# EAGLE design MFO (EAGLE 9.5.2)
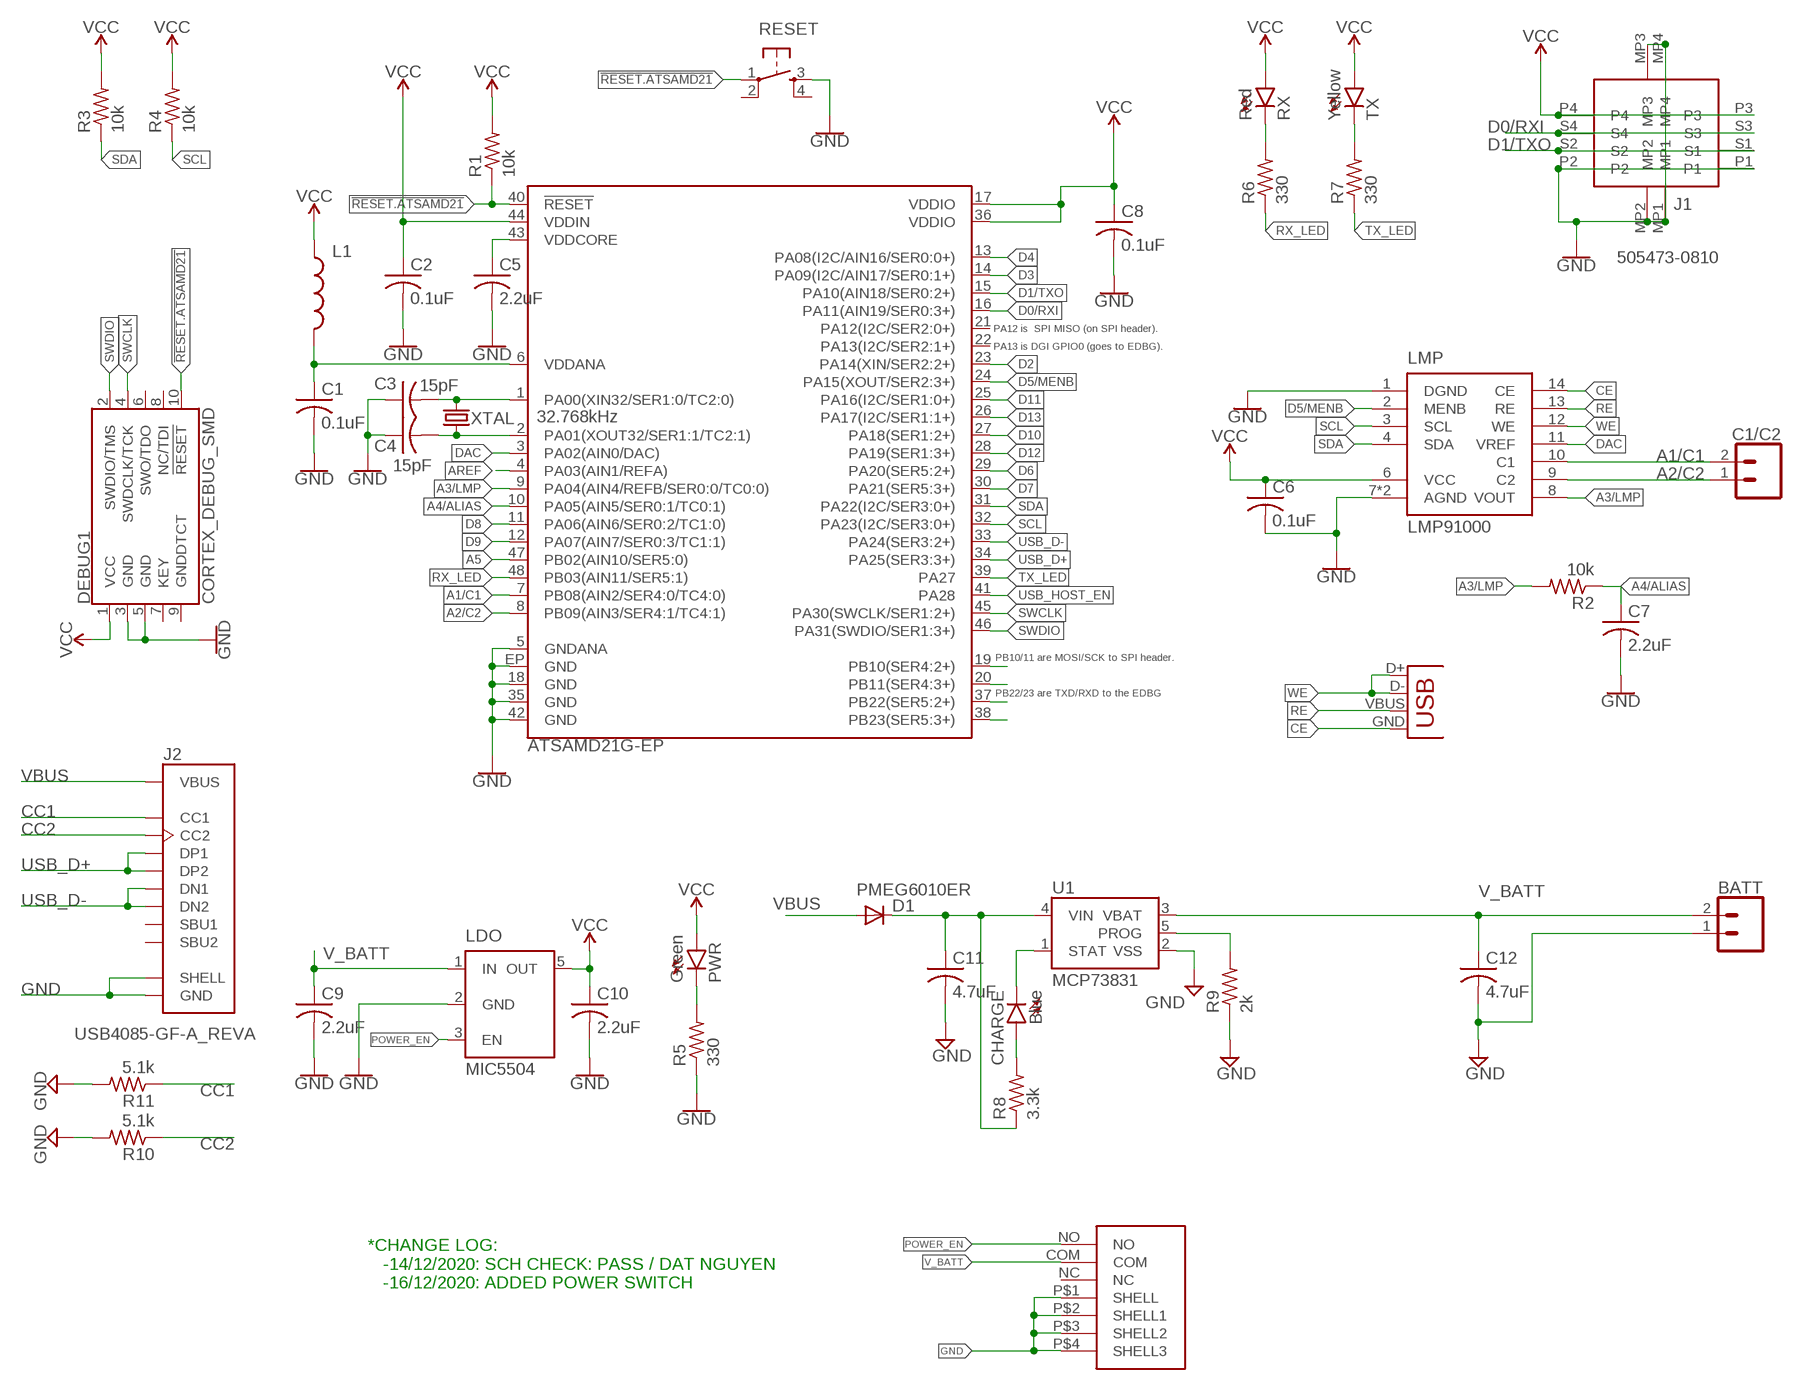
[diagram p0: schematic, sheet 1]

## Parts
ARDUINO  ATSAMD21G-EP  [QFN-48]
BATT  CONN_02  [1X02]
C1  0.1uF  C-USC0603  [C0603]
C1/C2  CONN_02  [1X02]
C2  0.1uF  C-USC0603  [C0603]
C3  15pF  C-USC0603  [C0603]
C4  15pF  C-USC0603  [C0603]
C5  2.2uF  C-USC0603  [C0603]
C6  0.1uF  C-USC0603  [C0603]
C7  2.2uF  C-USC0603  [C0603]
C8  0.1uF  C-USC0603  [C0603]
C9  2.2uF  C-USC0603  [C0603]
C10  2.2uF  C-USC0603  [C0603]
C11  4.7uF  C-USC0603  [C0603]
C12  4.7uF  C-USC0603  [C0603]
CHARGE  Blue  LEDCHIP-LED0805  [CHIP-LED0805]
D1  PMEG6010ER  DIODE_DIODE-SOD123  [DIODE_SOD123]
DEBUG1  CORTEX_DEBUG_SMD  [SAMTECH_FTSH-105-01]
J1  505473-0810  [5054730810]
J2  USB4085-GF-A_REVA  [GCT_USB4085-GF-A_REVA]
L1  FB - 30Ohm  INDUCTOR0603  [L0603]
LDO  MIC5504  [SOT23-5]
LMP  LMP91000  [WSON-14]
PWR  Green  LEDCHIP-LED0805  [CHIP-LED0805]
R1  10k  R-US_R0603  [R0603]
R2  10k  R-US_R0603  [R0603]
R3  10k  R-US_R0603  [R0603]
R4  10k  R-US_R0603  [R0603]
R5  330  R-US_R0603  [R0603]
R6  330  R-US_R0603  [R0603]
R7  330  R-US_R0603  [R0603]
R8  3.3k  R-US_R0603  [R0603]
R9  2k  R-US_R0603  [R0603]
R10  5.1k  R-US_R0603  [R0603]
R11  5.1k  R-US_R0603  [R0603]
RESET  SPST-PTS830GG140  [BUTTON-GULLWING]
RX  Red  LEDCHIP-LED0805  [CHIP-LED0805]
TX  Yellow  LEDCHIP-LED0805  [CHIP-LED0805]
U1  MCP73831  MCP73831SMD  [SOT23-5]
U$1  MSK-12C02SMD  [MSK-12C02SMD]
X1  USB-A-H  [USB-A-H]
XTAL  32.768kHz  CRYSTALECS-.327-12.5-1210-TR  [2-SMD.NOLEAD.1.2MMTO1.0MM]

## Nets
!RESET.ATSAMD21: ARDUINO.40(!RESET!) DEBUG1.10(!RESET) R1.1 RESET.1
A1/C1: ARDUINO.7(PB08(AIN2/SER4:0/TC4:0)) C1/C2.2 LMP.10(C1)
A2/C2: ARDUINO.8(PB09(AIN3/SER4:1/TC4:1)) C1/C2.1 LMP.9(C2)
A3/LMP: ARDUINO.9(PA04(AIN4/REFB/SER0:0/TC0:0)) LMP.8(VOUT) R2.2
A4/ALIAS: ARDUINO.10(PA05(AIN5/SER0:1/TC0:1)) C7.1 R2.1
A5: ARDUINO.47(PB02(AIN10/SER5:0))
AREF: ARDUINO.4(PA03(AIN1/REFA))
CC1: J2.A5(CC1) R11.1
CC2: J2.B5(CC2) R10.1
CE: LMP.14(CE) X1.GND
D0/RXI: ARDUINO.16(PA11(AIN19/SER0:3+)) J1.S3 J1.S4
D1/TXO: ARDUINO.15(PA10(AIN18/SER0:2+)) J1.S1 J1.S2
D2: ARDUINO.23(PA14(XIN/SER2:2+))
D3: ARDUINO.14(PA09(I2C/AIN17/SER0:1+))
D4: ARDUINO.13(PA08(I2C/AIN16/SER0:0+))
D5/MENB: ARDUINO.24(PA15(XOUT/SER2:3+)) LMP.2(MENB)
D6: ARDUINO.29(PA20(SER5:2+))
D7: ARDUINO.30(PA21(SER5:3+))
D8: ARDUINO.11(PA06(AIN6/SER0:2/TC1:0))
D9: ARDUINO.12(PA07(AIN7/SER0:3/TC1:1))
D10: ARDUINO.27(PA18(SER1:2+))
D11: ARDUINO.25(PA16(I2C/SER1:0+))
D12: ARDUINO.28(PA19(SER1:3+))
D13: ARDUINO.26(PA17(I2C/SER1:1+))
DAC: ARDUINO.3(PA02(AIN0/DAC)) LMP.11(VREF)
GND: ARDUINO.5(GNDANA) ARDUINO.18(GND) ARDUINO.35(GND) ARDUINO.42(GND) ARDUINO.EP(GND) BATT.1 C1.2 C2.2 C3.1 C4.1 C5.2 C6.2 C7.2 C8.2 C9.2 C10.2 C11.2 C12.2 DEBUG1.3(GND) DEBUG1.5(GND) J1.MP1 J1.MP2 J1.MP3 J1.MP4 J1.P1 J1.P2 J2.A1(GND) J2.A12(GND) J2.B1(GND) J2.B12(GND) J2.P1(SHELL) J2.P2(SHELL) J2.P3(SHELL) J2.P4(SHELL) LDO.2(GND) LMP.1(DGND) LMP.7(AGND) LMP.DAP(AGND) R5.1 R9.1 R10.2 R11.2 RESET.3 U1.2(VSS) U$1.P$1(SHELL) U$1.P$2(SHELL1) U$1.P$3(SHELL2) U$1.P$4(SHELL3)
N$1: R6.2 RX.C
N$2: ARDUINO.19(PB10(SER4:2+))
N$3: ARDUINO.20(PB11(SER4:3+))
N$4: ARDUINO.37(PB22(SER5:2+))
N$5: ARDUINO.38(PB23(SER5:3+))
N$6: R7.2 TX.C
N$7: PWR.C R5.2
N$9: R9.2 U1.5(PROG)
N$10: CHARGE.C U1.1(STAT)
N$12: CHARGE.A R8.2
N$28: ARDUINO.1(PA00(XIN32/SER1:0/TC2:0)) C3.2 XTAL.P$2
N$34: ARDUINO.2(PA01(XOUT32/SER1:1/TC2:1)) C4.2 XTAL.P$1
POWER_EN: LDO.3(EN) U$1.NO
RE: LMP.13(RE) X1.VBUS
RX_LED: ARDUINO.48(PB03(AIN11/SER5:1)) R6.1
SCL: ARDUINO.32(PA23(I2C/SER3:0+)) LMP.3(SCL) R4.1
SDA: ARDUINO.31(PA22(I2C/SER3:0+)) LMP.4(SDA) R3.1
SWCLK: ARDUINO.45(PA30(SWCLK/SER1:2+)) DEBUG1.4(SWDCLK/TCK)
SWDIO: ARDUINO.46(PA31(SWDIO/SER1:3+)) DEBUG1.2(SWDIO/TMS)
TX_LED: ARDUINO.39(PA27) R7.1
USB_D+: ARDUINO.34(PA25(SER3:3+)) J2.A6(DP1) J2.B6(DP2)
USB_D-: ARDUINO.33(PA24(SER3:2+)) J2.A7(DN1) J2.B7(DN2)
USB_HOST_EN: ARDUINO.41(PA28)
V_BATT: BATT.2 C9.1 C12.1 LDO.1(IN) U1.3(VBAT) U$1.COM
VBUS: D1.A J2.A4(VBUS) J2.A9(VBUS) J2.B4(VBUS) J2.B9(VBUS)
VCC: ARDUINO.17(VDDIO) ARDUINO.36(VDDIO) ARDUINO.44(VDDIN) C2.1 C6.1 C8.1 C10.1 DEBUG1.1(VCC) J1.P3 J1.P4 L1.1 LDO.5(OUT) LMP.6(VCC) PWR.A R1.2 R3.2 R4.2 RX.A TX.A
VDDANA1: ARDUINO.6(VDDANA) C1.1 L1.2
VDDCORE1: ARDUINO.43(VDDCORE) C5.1
VUSB: C11.1 D1.C R8.1 U1.4(VIN)
WE: LMP.12(WE) X1.D+ X1.D-
Unconnected: ARDUINO.21(PA12(I2C/SER2:0+)) ARDUINO.22(PA13(I2C/SER2:1+)) DEBUG1.6(SWO/TDO) DEBUG1.7(KEY) DEBUG1.8(NC/TDI) DEBUG1.9(GNDDTCT) J2.A8(SBU1) J2.B8(SBU2) RESET.2 RESET.4 U$1.NC

## Notes on the sheet
- PA12 is  SPI MISO (on SPI header).
- PA13 is DGI GPIO0 (goes to EDBG).
- PB10/11 are MOSI/SCK to SPI header.
- PB22/23 are TXD/RXD to the EDBG
- *CHANGE LOG:
     -14/12/2020: SCH CHECK: PASS / DAT NGUYEN
     -16/12/2020: ADDED POWER SWITCH

## Library data of the parts
ARDUINO = LinnesLab-Microcontrollers:ATSAMD21G-EP: Atmel SAMD21G SMART ARM-Based Microcontroller The Atmel ® | SMART ™ SAM D21 is a series of low-power microcontrollers using the 32-bit ARM ® Cortex ® -M0+ processor, and ranging from 32- to 64-pins with up to 256KB Flash and 32KB of SRAM. The SAM D21 devices operate at a maximum frequency of 48MHz and reach 2.46 CoreMark/MHz. They are designed for simple and intuitive migration with identical peripheral modules, hex compatible code, identical linear address map and pin compatible migration paths between all devices in the product series. All devices include intelligent and flexible peripherals, Atmel Event System for inter-peripheral signaling, and support for capacitive touch button, slider and wheel user interfaces. Datasheet <https://cdn.sparkfun.com/datasheets/Dev/Arduino/Boards/Atmel-42181-SAM-D21_Datasheet.pdf> SparkFun Products SparkFun SAMD21 Mini Breakout <https://www.sparkfun.com/products/13664> (DEV-13664) SparkFun SAMD21 Dev Breakout <https://www.sparkfun.com/products/13672> (DEV-13672)
BATT C1/C2 = CalvEngIO-Connectors:CONN_02: Multi connection point. Often used as Generic Header-pin footprint for 0.1 inch spaced/style header connections On any of the 0.1 inch spaced packages, you can populate with these: Break Away Headers - Straight <https://www.sparkfun.com/products/116> (PRT-00116) Break Away Male Headers - Right Angle <https://www.sparkfun.com/products/553> (PRT-00553) Female Headers <https://www.sparkfun.com/products/115> (PRT-00115) Break Away Headers - Machine Pin <https://www.sparkfun.com/products/117> (PRT-00117) Break Away Female Headers - Swiss Machine Pin <https://www.sparkfun.com/products/743> (PRT-00743) For SCREWTERMINALS and SPRING TERMINALS visit here: Screw Terimnals on SparkFun.com <https://www.sparkfun.com/search/results?term=Screw+Terminals> (5mm/3.5mm/2.54mm spacing) This device is also useful as a general connection point to wire up your design to another part of your project. Our various solder wires solder well into these plated through hole pads. Hook-Up Wire - Assortment (Stranded, 22 AWG) <https://www.sparkfun.com/products/11375> (PRT-11375) Hook-Up Wire - Assortment (Solid Core, 22 AWG) <https://www.sparkfun.com/products/11367> (PRT-11367) View the entire wire category on our website here <https://www.sparkfun.com/categories/141> Special notes: Molex polarized connector foot print use with: PRT-08233 with associated crimp pins and housings. 2.54_SCREWTERM for use with PRT-10571. 3.5mm Screw Terminal footprints for PRT-08084 5mm Screw Terminal footprints for use with PRT-08432
C1-C12 = rcl:C-US: CAPACITOR, American symbol; SPICEPREFIX: C
CHARGE PWR RX TX = led:LED: LED OSRAM: - CHIPLED LG R971, LG N971, LY N971, LG Q971, LY Q971, LO R971, LY R971 LH N974, LH R974 LS Q976, LO Q976, LY Q976 LO Q996 - Hyper CHIPLED LW Q18S LB Q993, LB Q99A, LB R99A - SideLED LS A670, LO A670, LY A670, LG A670, LP A670 LB A673, LV A673, LT A673, LW A673 LH A674 LY A675 LS A676, LA A676, LO A676, LY A676, LW A676 LS A679, LY A679, LG A679 - Hyper Micro SIDELED® LS Y876, LA Y876, LO Y876, LY Y876 LT Y87S - SmartLED LW L88C, LW L88S LB L89C, LB L89S, LG L890 LS L89K, LO L89K, LY L89K LS L896, LA L896, LO L896, LY L896 - TOPLED LS T670, LO T670, LY T670, LG T670, LP T670 LSG T670, LSP T670, LSY T670, LOP T670, LYG T670 LG T671, LOG T671, LSG T671 LB T673, LV T673, LT T673, LW T673 LH T674 LS T676, LA T676, LO T676, LY T676, LB T676, LH T676, LSB T676, LW T676 LB T67C, LV T67C, LT T67C, LS T67K, LO T67K, LY T67K, LW E67C LS E67B, LA E67B, LO E67B, LY E67B, LB E67C, LV E67C, LT E67C LW T67C LS T679, LY T679, LG T679 LS T770, LO T770, LY T770, LG T770, LP T770 LB T773, LV T773, LT T773, LW T773 LH T774 LS E675, LA E675, LY E675, LS T675 LS T776, LA T776, LO T776, LY T776, LB T776 LHGB T686 LT T68C, LB T68C - Hyper Mini TOPLED® LB M676 - Mini TOPLED Santana® LG M470 LS M47K, LO M47K, LY M47K Source: http://www.osram.convergy.de LUXEON: - LUMILED® LXK2-PW12-R00, LXK2-PW12-S00, LXK2-PW14-U00, LXK2-PW14-V00 LXK2-PM12-R00, LXK2-PM12-S00, LXK2-PM14-U00 LXK2-PE12-Q00, LXK2-PE12-R00, LXK2-PE12-S00, LXK2-PE14-T00, LXK2-PE14-U00 LXK2-PB12-K00, LXK2-PB12-L00, LXK2-PB12-M00, LXK2-PB14-N00, LXK2-PB14-P00, LXK2-PB14-Q00 LXK2-PR12-L00, LXK2-PR12-M00, LXK2-PR14-Q00, LXK2-PR14-R00 LXK2-PD12-Q00, LXK2-PD12-R00, LXK2-PD12-S00 LXK2-PH12-R00, LXK2-PH12-S00 LXK2-PL12-P00, LXK2-PL12-Q00, LXK2-PL12-R00 Source: www.luxeon.com KINGBRIGHT: KA-3528ASYC Source: www.kingbright.com
D1 = BE 420 Parts volume 2:DIODE_DIODE-: DIODE
DEBUG1 = CalvEngIO-Connectors:CORTEX_DEBUG: Cortex Debug Connector - 10 pin Supports JTAG debug, Serial Wire debug, and Serial Wire Viewer. PTH and SMD connector options available. General Connector Information <http://infocenter.arm.com/help/topic/com.arm.doc.faqs/attached/13634/cortex_debug_connectors.pdf> Products: PTH Connector <http://www.digikey.com/product-detail/en/cnc-tech/3220-10-0100-00/1175-1627-ND/3883661> -via Digi-Key SparkFun PSoc <https://www.sparkfun.com/products/13229> SparkFun T <https://www.sparkfun.com/products/13810>
J1 = SamacSys_Parts:505473-0810: Board to Board & Mezzanine Connectors SS Hybrid Pwr Recep 4 Pwr / 4S Contacts Source: Datasheet <https://componentsearchengine.com/Datasheets/1/505473-0810.pdf>; DESCRIPTION: Board to Board & Mezzanine Connectors SS Hybrid Pwr Recep 4 Pwr / 4S Contacts; HEIGHT: 0.58mm; MANUFACTURER_NAME: Molex; MANUFACTURER_PART_NUMBER: 505473-0810; MOUSER_PART_NUMBER: 538-5054730810; MOUSER_PRICE-STOCK: https://www.mouser.co.uk/ProductDetail/Molex/505473-0810?qs=IO9H2WQy3fJvsDYMwglDeg%3D%3D
J2 = USB4085-GF-A_REVA:USB4085-GF-A_REVA: USB 2.0 Type C Receptacle Dip Type, PCB Top Mount Check prices <https://pricing.snapeda.com/parts/USB4085-GF-A/Global%20Connector%20Technology/view-part?ref=eda>; AVAILABILITY: Warning; DESCRIPTION: USB-C (USB TYPE-C) USB 2.0 Receptacle Connector 24 (16+8 Dummy) Position Through Hole, Right Angle; MF: Global Connector Technology; MP: USB4085-GF-A; PACKAGE: Package; PRICE: None; PURCHASE-URL: https://pricing.snapeda.com/search/part/USB4085-GF-A/?ref=eda
L1 = LinnesLab-Passives:INDUCTOR; PROD_ID: RES-07859
LDO = LinnesLab-Power:MIC5504: MIC5504 Voltage Regulator Output Voltages: 1.0V to 3.3V Input Voltages: 2.5V to 5.5V Link to Datasheet http://ww1.microchip.com/downloads/en/DeviceDoc/MIC550X.pdf
LMP = CalvEngIO-Sensors:LMP91000: Integrated Potentiostat for Electrochemical Measurements of Gases and Fluids from Texas Instruments.
R1-R11 = rcl:R-US_: RESISTOR, American symbol; SPICEPREFIX: R
RESET = LinnesLab-Switches:SPST-PTS830GG140
U1 = SparkFun:MCP73831
U$1 = MSK-12C02 SMD Switch:MSK-12C02SMD
X1 = con-usb:USB: USB Connectors
XTAL = LinnesLab-Clocks:CRYSTAL

## Board
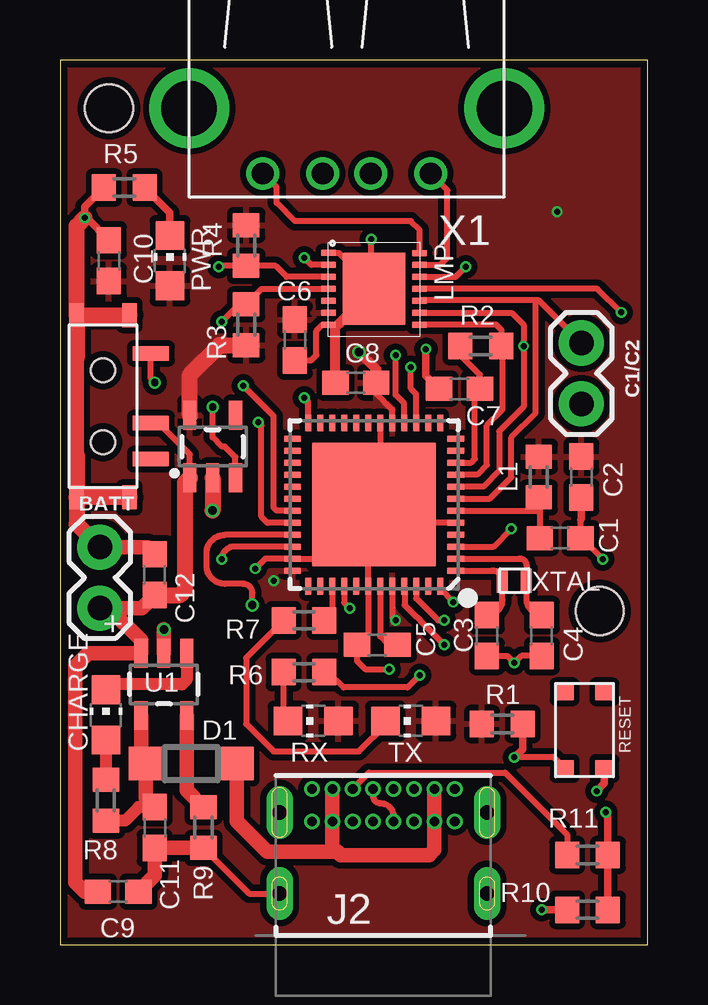
[diagram p1: board, top side]
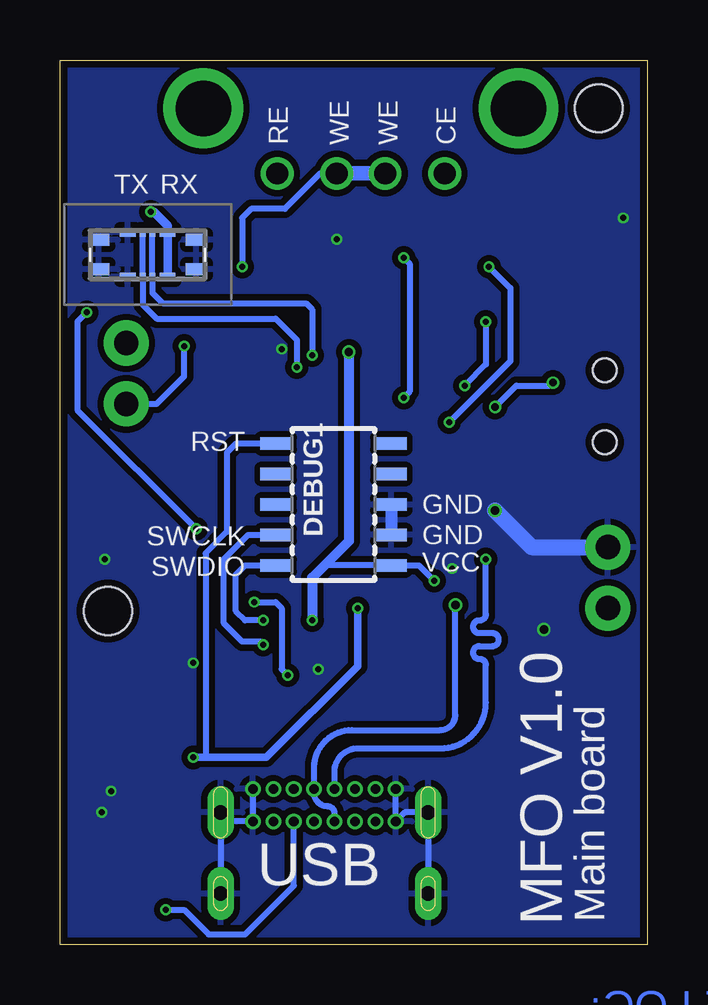
[diagram p2: board, bottom side, seen from below]

Size 24.48 x 36.86 mm. Coordinates in mm from the lower left corner, seen from the top.
Outline: 0,0 24.48,0 24.48,36.86 0,36.86 0,0
Copper layers (1*16): Top 0.035mm / dielectric 1.5mm / Bottom 0.035mm
Design rules "default *": minimum track width 0.1mm, minimum drill 0.1mm, track to track 0.1mm, track to pad 0.1mm, pad to pad 0.1mm, via to via 0.1mm, smd to smd 0.1mm, copper to edge 0.3mm, drill to drill 0.2mm, minimum pad ring 4mil, minimum via ring 4mil, stop-mask expansion 4mil, vias tented up to drill 0mil, thermal gap 10mil
Holes 2 mm at 2.03,34.85 22.48,13.89

### Footprints (pad centres in the part's own frame; a part is rotated, then mirrored left to right if it is on the bottom)
QFN-48 = smd 0.7 x 0.25: 1 -3.4,2.75; 2 -3.4,2.25; 3 -3.4,1.75; 4 -3.4,1.25; 5 -3.4,0.75; 6 -3.4,0.25; 7 -3.4,-0.25; 8 -3.4,-0.75; 9 -3.4,-1.25; 10 -3.4,-1.75; 11 -3.4,-2.25; 12 -3.4,-2.75; 25 3.4,-2.75; 26 3.4,-2.25; 27 3.4,-1.75; 28 3.4,-1.25; 29 3.4,-0.75; 30 3.4,-0.25; 31 3.4,0.25; 32 3.4,0.75; 33 3.4,1.25; 34 3.4,1.75; 35 3.4,2.25; 36 3.4,2.75 | smd 0.25 x 0.7: 13 -2.75,-3.4; 14 -2.25,-3.4; 15 -1.75,-3.4; 16 -1.25,-3.4; 17 -0.75,-3.4; 18 -0.25,-3.4; 19 0.25,-3.4; 20 0.75,-3.4; 21 1.25,-3.4; 22 1.75,-3.4; 23 2.25,-3.4; 24 2.75,-3.4; 37 2.75,3.4; 38 2.25,3.4; 39 1.75,3.4; 40 1.25,3.4; 41 0.75,3.4; 42 0.25,3.4; 43 -0.25,3.4; 44 -0.75,3.4; 45 -1.25,3.4; 46 -1.75,3.4; 47 -2.25,3.4; 48 -2.75,3.4 | smd 5.15 x 5.15: EP 0,0
1X02 = drill 1.016 pad 1.88: 1 0,0; 2 2.54,0
C0603 = smd 1.1 x 1: 1 -0.85,0; 2 0.85,0
CHIP-LED0805 = smd 1.2 x 1.2: A 0,-1.05; C 0,1.05
DIODE_SOD123 = smd 1.4 x 1.4: A 1.9,0; C -1.9,0
SAMTECH_FTSH-105-01 = smd 0.508 x 1.27: 1 -2.54,-2.413; 2 -2.54,2.413; 3 -1.27,-2.413; 4 -1.27,2.413; 5 0,-2.413; 6 0,2.413; 7 1.27,-2.413; 8 1.27,2.413; 9 2.54,-2.413; 10 2.54,2.413
5054730810 = smd 0.89 x 0.51: MP1 -2.035,-0.615; MP2 -2.035,0.615; MP3 2.035,0.615; MP4 2.035,-0.615 | smd 0.66 x 0.35: P1 -0.83,-0.925; P2 -0.83,0.925; P3 0.83,-0.925; P4 0.83,0.925 | smd 0.24 x 0.35: S1 -0.2,-0.925; S2 -0.2,0.925; S3 0.2,-0.925; S4 0.2,0.925
GCT_USB4085-GF-A_REVA = drill 0.4 pad 0.65: A1 -2.975,4.025; A4 -2.125,4.025; A5 -1.275,4.025; A6 -0.425,4.025; A7 0.425,4.025; A8 1.275,4.025; A9 2.125,4.025; A12 2.975,4.025; B1 2.975,2.675; B4 2.125,2.675; B5 1.275,2.675; B6 0.425,2.675; B7 -0.425,2.675; B8 -1.275,2.675; B9 -2.125,2.675; B12 -2.975,2.675 | drill 0.6 pad 1.108 long: P1 -4.325,3.045; P2 4.325,3.045; P3 4.325,-0.335; P4 -4.325,-0.335
L0603 = smd 1 x 1.1: 1 -0.85,0; 2 0.85,0
SOT23-5 = smd 0.55 x 1.2: 1 -0.95,-1.3; 2 0,-1.3; 3 0.95,-1.3; 4 0.95,1.3; 5 -0.95,1.3
WSON-14 = smd 0.6 x 0.25: 1 0,3.5; 2 0,3; 3 0,2.5; 4 0,2; 5 0,1.5; 6 0,1; 7 0,0.5; 8 3.8,0.5; 9 3.8,1; 10 3.8,1.5; 11 3.8,2; 12 3.8,2.5; 13 3.8,3; 14 3.8,3.49 | smd 2.6 x 3: DAP 1.9,2.008
R0603 = smd 1 x 1.1: 1 -0.85,0; 2 0.85,0
BUTTON-GULLWING = smd 0.7 x 0.75: 1 -1.6,0.825; 2 1.6,0.825; 3 -1.6,-0.825; 4 1.6,-0.825
MSK-12C02SMD = smd 0.6 x 1.5: COM 4.1,3.4; NC 5.6,3.4; NO 1.2,3.4 | smd 1 x 0.6: P$1 -0.4,0.3; P$2 7.2,0.3; P$3 7.2,2.5; P$4 -0.4,2.5 | hole 1: 4.9,1.4; 1.9,1.4
USB-A-H = drill 0.914: D+ 2.718,-1.003; D- 2.718,1.003; GND 2.718,-3.493; VBUS 2.718,3.493 | drill 2.311: P$5 0,-6.566; P$6 0,6.566
2-SMD.NOLEAD.1.2MMTO1.0MM = smd 0.45 x 1: P$1 -0.5,0; P$2 0.5,0

### Placement (x,y rotation side)
ARDUINO  13.08,18.34 180 top
BATT  1.65,16.56 270 top
C1  20.83,16.94 0 top
C1/C2  21.72,22.53 90 top
C2  21.72,19.48 270 top
C3  17.78,12.88 90 top
C4  20.07,12.88 90 top
C5  13.21,12.49 180 top
C6  9.78,25.19 270 top
C7  16.64,23.16 180 top
C8  12.32,23.42 180 top
C9  2.41,2.21 0 top
C10  2.03,28.5 90 top
C11  3.94,4.87 270 top
C12  3.94,15.42 90 top
CHARGE  1.9,9.57 0 top
D1  5.46,7.54 0 top
DEBUG1  13.08,18.34 90 bottom
J1  20.83,28.75 0 bottom
J2  13.46,2.46 0 top
L1  19.94,19.48 270 top
LDO  6.35,20.75 0 top
LMP  11.18,25.32 0 top
PWR  4.57,28.5 0 top
R1  18.41,9.19 180 top
R2  17.53,24.94 0 top
R3  7.75,25.83 270 top
R4  7.75,29.13 90 top
R5  2.67,31.54 0 top
R6  10.16,11.35 180 top
R7  10.16,13.51 180 top
R8  1.9,6.02 90 top
R9  5.97,4.87 90 top
R10  21.97,1.45 0 top
R11  21.97,3.73 0 top
RESET  21.84,8.94 90 top
RX  10.54,9.32 90 top
TX  14.61,9.32 90 top
U1  4.32,10.84 180 top
U$1  0.38,25.83 270 top
X1  11.94,34.85 270 top
XTAL  18.92,15.16 180 top

### Tracks (layer width: path | path; a pad name or v marks a point on that pad's centre or on a via)
!RESET.ATSAMD21  (via drill 0.25)
  Top 0.254: ARDUINO.40 11.83,14.25 v12.06,14.02 | RESET.1 20.56,7.79 v18.92,7.79
  Top 0.305: R1.1 19.27,8.14 v18.92,7.79
  Bottom 0.254: DEBUG1.10 17.14,20.88 17.53,20.49 17.53,17.19 18.41,16.3 18.41,7.92 18.29,7.79
  Bottom 0.305: v12.06,14.02 12.06,11.61 15.88,7.79 18.29,7.79 v18.92,7.79
A1/C1
  Top 0.254: ARDUINO.7 17.9,18.59 18.8,19.48 18.8,21.13 19.81,22.15 19.81,26.84 | 19.81,26.84 15,26.84 LMP.10 | C1/C2.2 19.94,26.84 19.81,26.84
A2/C2  (via drill 0.25)
  Top 0.254: LMP.9 18.81,26.32 19.3,25.83 v19.3,24.94 19.3,22.4 18.29,21.38 18.29,19.73 17.64,19.09 ARDUINO.8
  Bottom 0.254: C1/C2.1 20.45,22.53 19.3,23.67 v19.3,24.94
A3/LMP
  Top 0.254: ARDUINO.9 16.5,19.61 17.4,19.61 17.78,19.99 17.78,21.64 18.41,22.27 18.41,24.9 R2.2 18.38,25.61 18.16,25.83 LMP.8
A4/ALIAS
  Top 0.254: R2.1 16.68,24.56 17.49,23.75 C7.1 17.27,22.95 17.27,20.24 17.12,20.09 ARDUINO.10
CC1
  Top 0.254: J2.A5 12.86,7.16 18.54,7.16 21.12,4.58 R11.1
CC2  (via drill 0.25)
  Top 0.305: R10.1 v20.07,1.45
  Bottom 0.254: v20.07,1.45 19.3,1.45 18.29,0.43 16.76,0.43 14.74,2.46 J2.B5
CE
  Top 0.254: LMP.14 14.98,29.78 14.61,30.15 9.78,30.15 9.02,30.91 9.02,31.56 X1.GND
D0/RXI  (via drill 0.25)
  Top 0.254: ARDUINO.16 14.33,22.55 13.97,22.91 v13.97,24.56
  Bottom 0.254: v13.97,24.56 13.97,26.46 14.22,26.72 20.19,26.72 20.63,27.15 J1.S3 J1.S4
D1/TXO  (via drill 0.25)
  Top 0.254: ARDUINO.15 14.83,22.94 14.61,23.16 v14.61,24.05
  Bottom 0.254: v14.61,24.05 14.61,25.19 15.49,26.08 20.45,26.08 21.03,26.66 J1.S1 J1.S2
D5/MENB  (via drill 0.25)
  Top 0.254: LMP.2 10.46,28.32 v10.16,28.62 | ARDUINO.24 10.33,22.61 v10.16,22.78
  Bottom 0.254: v10.16,28.62 9.91,28.37 9.91,23.04 v10.16,22.78
DAC  (via drill 0.25)
  Top 0.254: ARDUINO.3 18.06,16.59 v18.8,17.32 | v23.37,26.34 22.38,27.32 LMP.11
  Bottom 0.254: v23.37,26.34 23.75,25.96 23.75,22.27 v18.8,17.32
GND  (via drill 0.25, 0.35)
  Top 0.254: ARDUINO.18 13.33,20.49 13.08,20.24 13.08,18.59 | 13.08,18.59 ARDUINO.EP 13.08,18.21 | LMP.1 11.61,28.82 13.08,27.36 LMP.DAP | 12.06,26.19 11.7,25.82 LMP.7 10.91,25.82 10.67,25.58 10.67,24.56 10.45,24.34 C6.2 | 12.06,26.19 12.24,26.36 | LMP.DAP 13.08,27.46 12.95,27.58 v12.95,29.39 | v13.72,11.48 12.7,11.48 12.36,11.82 C5.2 12.83,12.97 ARDUINO.42 12.83,18.34 13.08,18.59 | C3.1 18.63,12.03 v18.92,11.73 19.22,12.03 C4.1 | 21.68,17.7 C1.2 21.72,16.94 v22.61,16.05 | ARDUINO.5 13.32,17.59 13.08,17.83 13.08,18.21 | 13.08,18.21 10.96,16.09 ARDUINO.35 8.54,16.09 v8.13,15.67 | 12.06,26.19 12.06,26.32 LMP.DAP | R9.1 7.87,2.13 J2.P4
  Top 0.305: C2.2 21.72,17.74 21.68,17.7 | RESET.3 22.67,6.71 v22.35,6.4 | R10.2 R11.2 22.82,5.42 v22.73,5.51 | C10.2 1.1,30.27 v1.02,30.27 1.02,30.74 R5.1 | C7.2 15.24,23.71 v15.24,24.81
  Top 0.406: C8.2 11.47,25.72 12.06,26.32
  Top 0.61: R9.1 C11.2 3.94,2.88 C9.2 | U1.2 v4.32,13.13 | C12.2 3.64,16.56 BATT.1
  Top 0.66: U$1.P$3 U$1.P$2 | U$1.P$1 U$1.P$4 | U$1.P$1 0.68,24.43 0.65,24.4 0.65,20.46 0.68,20.43 U$1.P$2 | U$1.P$2 0.68,17.53 BATT.1 | U$1.P$1 0.68,29.94 v1.02,30.27 | LDO.2 v6.35,18.08
  Bottom 0.254: J2.A12 J2.B1 17.42,5.14 J2.P2 J2.P3 | J2.A1 J2.B12 10.12,5.51 J2.P1 J2.P4
  Bottom 0.508: DEBUG1.5 DEBUG1.3
  Bottom 0.66: v6.35,18.08 4.83,16.56 BATT.1
  pour Bottom (isolate 0.254): -0.38,37.01 -0.38,-0.59 24.64,-0.59 24.64,37.01
N$1
  Top 0.254: RX.C 9.31,9.5 R6.2
N$6
  Top 0.254: R7.2 7.75,11.95 7.75,9.19 8.89,8.05 12.45,8.05 13.55,9.16 TX.C
N$7
  Top 0.305: PWR.C 4.57,30.49 R5.2
N$9
  Top 0.61: U1.5 5.27,6.43 R9.2
N$10
  Top 0.508: U1.1 5.27,11.03 5.08,10.84 2.12,10.84 CHARGE.C
N$12
  Top 0.508: CHARGE.A R8.2
N$28
  Top 0.254: ARDUINO.1 18,15.59 arc-90 XTAL.P$2 18.42,14.37 arc-90 C3.2
N$34
  Top 0.254: ARDUINO.2 19.14,16.09 arc-90 19.43,15.8 XTAL.P$1 arc-90 19.43,15.15 19.43,14.4 arc90 20.07,13.76 C4.2
POWER_EN  (via drill 0.3)
  Top 0.254: LDO.3 7.3,20.31 6.86,20.75 6.73,20.75 6.35,21.13 v6.35,22.4 | v3.94,23.42 3.78,23.57 U$1.NO
  Bottom 0.254: v6.35,22.4 5.46,23.29 4.06,23.29 v3.94,23.42
RE
  Top 0.254: LMP.13 15.83,28.32 16.13,28.62 16.13,31.43 X1.VBUS
RX_LED  (via drill 0.25)
  Top 0.254: R6.1 11.18,11.35 11.81,10.72 14.48,10.72 v14.99,11.22 | v16.38,14.27 15.83,14.82 ARDUINO.48
  Bottom 0.254: v16.38,14.27 15.49,14.27 15.24,14.02 15.24,11.48 v14.99,11.22
SCL  (via drill 0.25)
  Top 0.254: LMP.3 9.44,27.82 8.98,28.28 R4.1 6.64,28.28 v6.6,28.24 | ARDUINO.32 9.67,17.57 8.64,17.57 8.38,17.83 8.38,21.64 v8.25,21.77
  Bottom 0.254: v6.6,28.24 5.71,27.35 5.71,24.3 v8.25,21.77
SDA  (via drill 0.25)
  Top 0.254: LMP.4 8.38,27.31 R3.1 7.45,26.68 v6.73,25.96 | ARDUINO.31 9.01,18.09 8.89,18.21 8.89,22.02 v7.62,23.29
  Bottom 0.254: v6.73,25.96 6.73,24.18 v7.62,23.29
SWCLK  (via drill 0.25)
  Top 0.254: ARDUINO.45 14.35,14.92 14.35,14.15 14.84,13.65 14.85,13.65 15.01,13.49 15.01,13.48 v16,12.49
  Bottom 0.254: v16,12.49 16.13,12.62 16.89,12.62 17.65,13.38 17.65,16.05 16.64,17.07 DEBUG1.4
SWDIO  (via drill 0.25)
  Top 0.254: ARDUINO.46 14.83,14.43 15.75,13.51 v16,13.51
  Bottom 0.254: v16,13.51 16.76,13.51 17.14,13.89 17.14,15.42 16.76,15.8 DEBUG1.2
TX_LED
  Top 0.254: ARDUINO.39 11.33,13.83 R7.1
USB_D+  (via drill 0.25)
  Top 0.254: J2.A6 13.04,6.19 arc90 13.34,5.89 arc-90 13.89,5.34 J2.B6 | ARDUINO.34 7.27,16.59 arc90 v6.73,16.05
  Bottom 0.254: J2.A6 13.04,7.2 arc90 12.06,8.18 8.64,8.18 arc-90 6.73,10.08 6.73,11.64 arc-90 6.98,11.9 7.01,11.9 arc90 7.26,12.15 7.26,12.18 arc90 7.01,12.44 6.45,12.44 arc-90 6.2,12.69 6.2,12.72 arc-90 6.45,12.97 7.01,12.97 arc90 7.26,13.23 7.26,13.26 arc90 7.01,13.51 6.98,13.51 arc-90 6.73,13.76 v6.73,16.05
USB_D-  (via drill 0.35)
  Top 0.254: v8,14.15 8,14.65 arc90 7.62,15.03 6.86,15.03 arc-90 6.1,15.8 6.1,16.3 arc-90 6.86,17.07 9.66,17.07 arc90 ARDUINO.33
  Bottom 0.254: J2.B7 13.04,5.46 arc-90 13.34,5.76 arc90 13.89,6.31 J2.A7 13.89,7.37 arc90 12.32,8.94 8.64,8.94 arc-90 8,9.57 v8,14.15
V_BATT
  Top 0.254: LDO.1 5.4,20.43 4.1,21.73 U$1.COM
  Top 0.61: C9.1 1.02,2.21 0.63,2.59 0.63,11.61 1.17,12.14 U1.3 3.37,12.68 2.03,14.02 BATT.2 3.39,14.02 C12.1
  Top 0.66: C12.1 4.99,14.56 5.21,14.78 5.21,19.26 LDO.1
VBUS
  Top 0.61: J2.A9 J2.B4 15.59,3.95 15.37,3.73 11.68,3.73 11.56,3.86 | J2.A4 J2.B9 11.34,4.08 11.56,3.86 | D1.A 7.36,5.13 8.64,3.86 11.56,3.86
VCC  (via drill 0.25, 0.35)
  Top 0.254: ARDUINO.44 13.84,13.64 v13.97,13.51 | ARDUINO.17 13.83,22.26 13.84,22.27 13.17,22.95 C8.1
  Top 0.406: C8.1 13.17,23.96 v12.45,24.69
  Top 0.66: LDO.5 5.4,23.74 6.64,24.98 R3.2
  Bottom 0.254: v8.89,15.16 9.53,15.8 DEBUG1.1 13.46,15.8 13.97,15.29
  Bottom 0.356: J1.P3 J1.P4 20,29.95 20.57,30.53 v20.7,30.53
  Bottom 0.406: v12.45,24.69 12.45,16.81 13.97,15.29 v13.97,13.51
  pour Top (isolate 0.254): -0.25,36.88 -0.25,-0.46 24.51,-0.46 24.51,36.88
VDDANA1
  Top 0.254: L1.2 19.98,18.59 19.98,18.08 | 19.98,18.08 C1.1 | ARDUINO.6 19.98,18.08
VDDCORE1
  Top 0.254: C5.1 13.68,12.49 13.33,12.84 ARDUINO.43
VUSB
  Top 0.508: C11.1 3.26,5.72 2.71,5.17 R8.1
  Top 0.61: U1.4 3.37,7.73 D1.C 3.56,6.1 C11.1
WE  (via drill 0.25)
  Top 0.254: LMP.12 16.47,27.82 v16.89,28.24
  Bottom 0.254: X1.D- 13.64,32.13 15.11,30.66 16.51,30.66 16.89,30.27 v16.89,28.24
  Bottom 0.61: X1.D+ X1.D-

### Text on the board
Bottom: *CHANGE LOG: / - 14/12/2020: PCB CHECK: PASS / DAT NGUYEN / - 16/12/2020: ADDED MAIN POWER SWITCH / / *NOTE: / - Polygon isolate: 10
tNames: +
bNames: CE | WE | WE | RE | RX | TX | RST | GND | SWCLK | GND | SWDIO | VCC | USB | Main board | MFO V1.0